# EAGLE design mpu6050 (EAGLE 5.11)
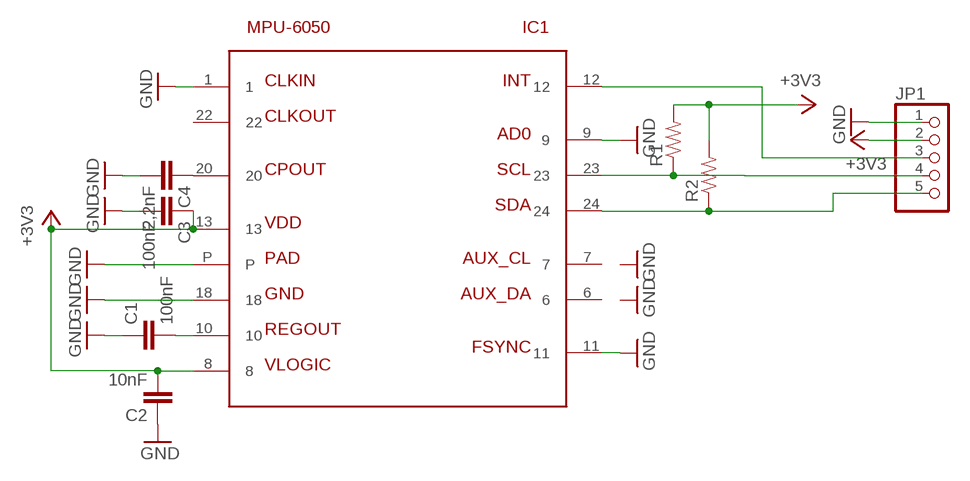
[diagram p0: schematic, sheet 1]

## Parts
C1  100nF  CAP0402-CAP  [0402-CAP]
C2  10nF  CAP0402-CAP  [0402-CAP]
C3  100nF  CAP0402-CAP  [0402-CAP]
C4  2,2nF  CAP0402-CAP  [0402-CAP]
IC1  MPU-6050  [QFN24]
JP1  PINHD-1X05_2.54  [1X05]
R1  RESISTOR0402-RES  [0402-RES]
R2  RESISTOR0402-RES  [0402-RES]

## Nets
+3V3: C2.2 C3.1 IC1.8 IC1.13 JP1.2 R1.2 R2.2
GND: C1.1 C2.1 C3.2 C4.2 IC1.1 IC1.9 IC1.11 IC1.18 IC1.P JP1.1
INT: IC1.12 JP1.3
N$2: C1.2 IC1.10
N$3: C4.1 IC1.20
SCL: IC1.23 JP1.4 R1.1
SDA: IC1.24 JP1.5 R2.1
Unconnected: IC1.6 IC1.7 IC1.22

## Library data of the parts
C1-C4 = SparkFun:CAP: Capacitor Standard 0603 ceramic capacitor, and 0.1" leaded capacitor.
IC1 = seb:MPU-6050
JP1 = pinhead-2:PINHD-1X05: PIN HEADER
R1 R2 = SparkFun:RESISTOR: Resistor Basic schematic elements and footprints for 0603, 1206, and PTH 1/10th watt (small) resistors.

## Board
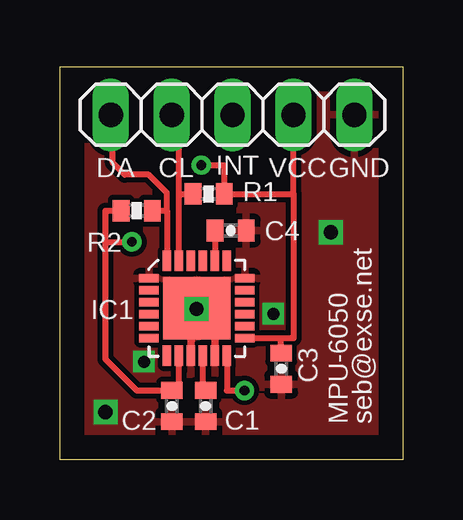
[diagram p1: board, top side]
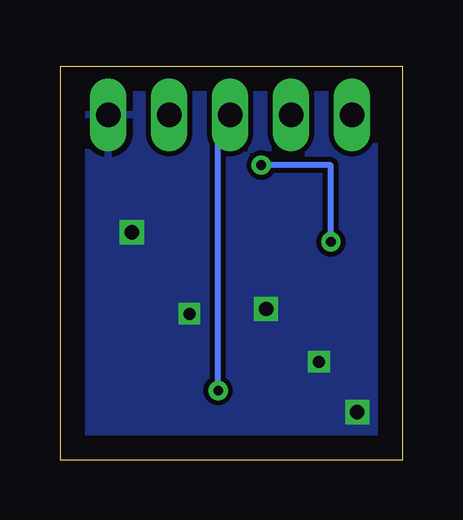
[diagram p2: board, bottom side, seen from below]

Size 14.3 x 16.4 mm. Coordinates in mm from the lower left corner, seen from the top.
Outline: 0,16.4 14.3,16.4 14.3,0 0,0 0,16.4
Copper layers (1*16): Top 0.035mm / dielectric 1.5mm / Bottom 0.035mm
Design rules "default *": minimum track width 10mil, minimum drill 0.4mm, track to track 8mil, track to pad 8mil, pad to pad 8mil, via to via 8mil, smd to smd 8mil, copper to edge 40mil, drill to drill 8mil, minimum pad ring 10mil, minimum via ring 8mil, stop-mask expansion 4mil, vias tented up to drill 0.6mm, thermal gap 10mil

### Footprints (pad centres in the part's own frame; a part is rotated, then mirrored left to right if it is on the bottom)
0402-CAP = smd 0.7 x 0.9: 1 -0.65,0; 2 0.65,0
QFN24 = smd 0.8 x 0.35: 1 -2,1.25; 2 -2,0.75; 3 -2,0.25; 4 -2,-0.25; 5 -2,-0.75; 6 -2,-1.25; 13 2,-1.25; 14 2,-0.75; 15 2,-0.25; 16 2,0.25; 17 2,0.75; 18 2,1.25 | smd 0.35 x 0.85: 7 -1.25,-1.975; 8 -0.75,-1.975; 9 -0.25,-1.975; 10 0.25,-1.975; 11 0.75,-1.975; 12 1.25,-1.975; 19 1.25,1.975; 20 0.75,1.975; 21 0.25,1.975; 22 -0.25,1.975; 23 -0.75,1.975; 24 -1.25,1.975 | smd 2.8 x 2.6: P 0,0
1X05 = drill 1.016 long: 1 -5.08,0; 2 -2.54,0; 3 0,0; 4 2.54,0; 5 5.08,0
0402-RES = smd 0.7 x 0.9: 1 -0.65,0; 2 0.65,0

### Placement (x,y rotation side)
C1  6.08,2.25 90 top
C2  4.67,2.25 90 top
C3  9.23,3.81 270 top
C4  7.12,9.57 0 top
IC1  5.71,6.33 0 top
JP1  7.2,14.4 180 top
R1  6.2,11.1 0 top
R2  3.2,10.4 180 top

### Tracks (layer width: path | path; a pad name or v marks a point on that pad's centre or on a via)
+3V3  (via drill 0.4)
  Top 0.254: IC1.8 4.96,2.95 C2.2 3.2,2.9 1.9,4.2 1.9,9.1 | 9.74,11.1 9.74,6.4 9.74,5.08 9.2,5.08 | 9.74,11.1 JP1.2 | R2.2 1.9,10.4 1.9,9.1 | 9.74,11.1 R1.2 6.85,12.3 v5.9,12.3 | 1.9,9.1 v3,9.1 | 9.2,5.08 IC1.13 | C3.1 9.2,4.46 9.2,5.08
  Bottom 0.254: v3,9.1 3,12.3 v5.9,12.3
GND  (via drill 0.5, 0.6)
  Top 0.305: IC1.11 6.46,6.3 v5.7,6.3 | IC1.9 5.46,6.3
  other vias: 11.3,9.5 1.9,2 3.5,4.1 8.9,6.1
  pour Bottom: 0,16.4 13.5,16.4 13.5,0 0,0
  pour Top: 0,16.4 13.5,16.4 13.5,0 0,0
INT  (via drill 0.4)
  Top 0.254: IC1.12 6.96,2.9 7.2,2.9 | 7.2,2.9 v7.7,2.9 7.2,2.9
  Bottom 0.254: JP1.3 7.7,13.9 v7.7,2.9
N$2
  Top 0.254: C1.2 5.96,2.85 IC1.10
N$3
  Top 0.254: IC1.20 6.46,9.67 C4.1
SCL
  Top 0.254: IC1.23 4.96,11.1 | 4.96,11.1 R1.1 | JP1.4 4.96,14.4 4.96,11.1
SDA
  Top 0.254: 4.46,10.4 IC1.24 | R2.1 4.46,10.4 | JP1.5 2.2,14.4 2.2,12.4 2.7,11.9 3.7,11.9 4.46,11.14 4.46,10.4

### Text on the board
tNames: DA | CL | INT | VCC | GND | MPU-6050 | seb@exse.net